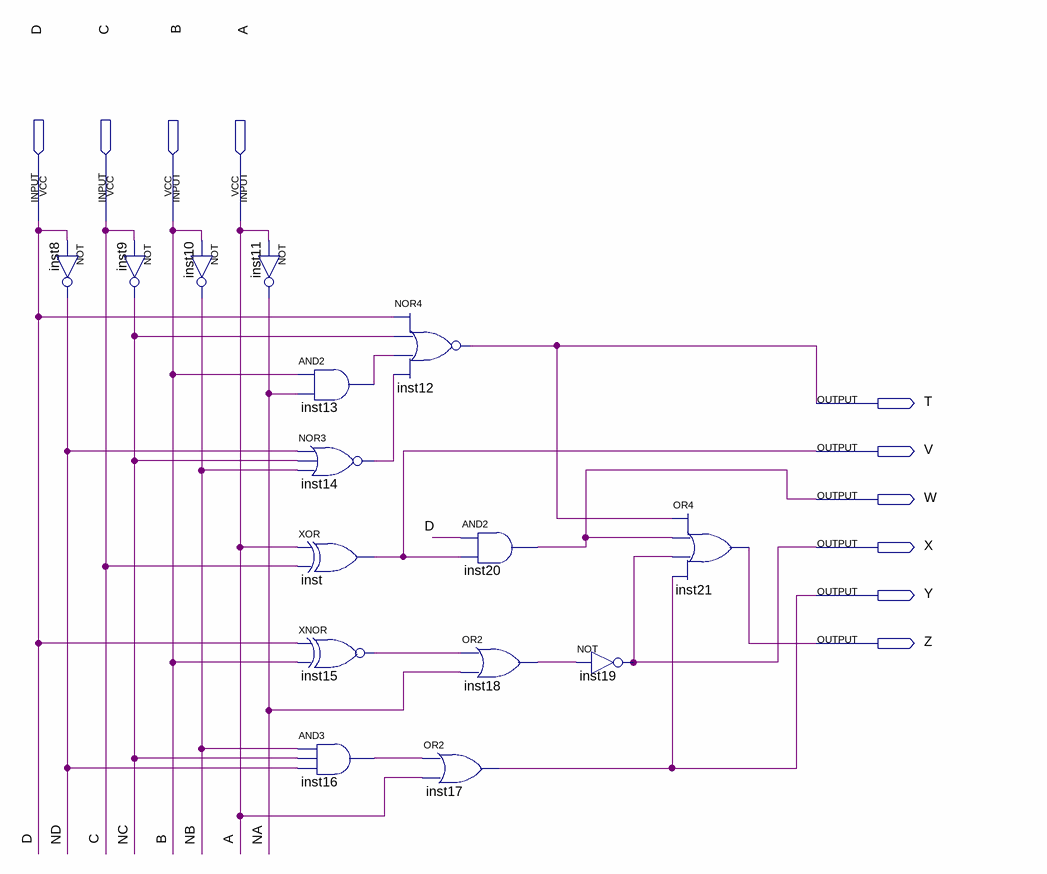
[diagram p0: schematic sheet]
// Quartus schematic FDD_Lab2.bdf as structural Verilog: 15 symbols, 10 pins
module FDD_Lab2 (
  input  D,
  input  C,
  input  B,
  input  A,
  output T,
  output V,
  output W,
  output X,
  output Y,
  output Z
);

  wire inst13_out, inst14_out, inst15_out, inst16_out, inst18_out, NA, NB, NC, ND;

  not inst8 (ND, D);
  not inst9 (NC, C);
  not inst10 (NB, B);
  not inst11 (NA, A);
  and inst13 (inst13_out, B, NA);
  nor inst14 (inst14_out, ND, NC, NB);
  xor inst (V, A, C);
  xnor inst15 (inst15_out, D, B);
  and inst16 (inst16_out, NB, NC, ND);
  nor inst12 (T, D, NC, inst13_out, inst14_out);
  or inst17 (Y, inst16_out, A);
  and inst20 (W, D, V);
  or inst18 (inst18_out, inst15_out, NA);
  not inst19 (X, inst18_out);
  or inst21 (Z, T, W, X, Y);
endmodule
